# Altium project HERSEYBASTAN.PrjPcb
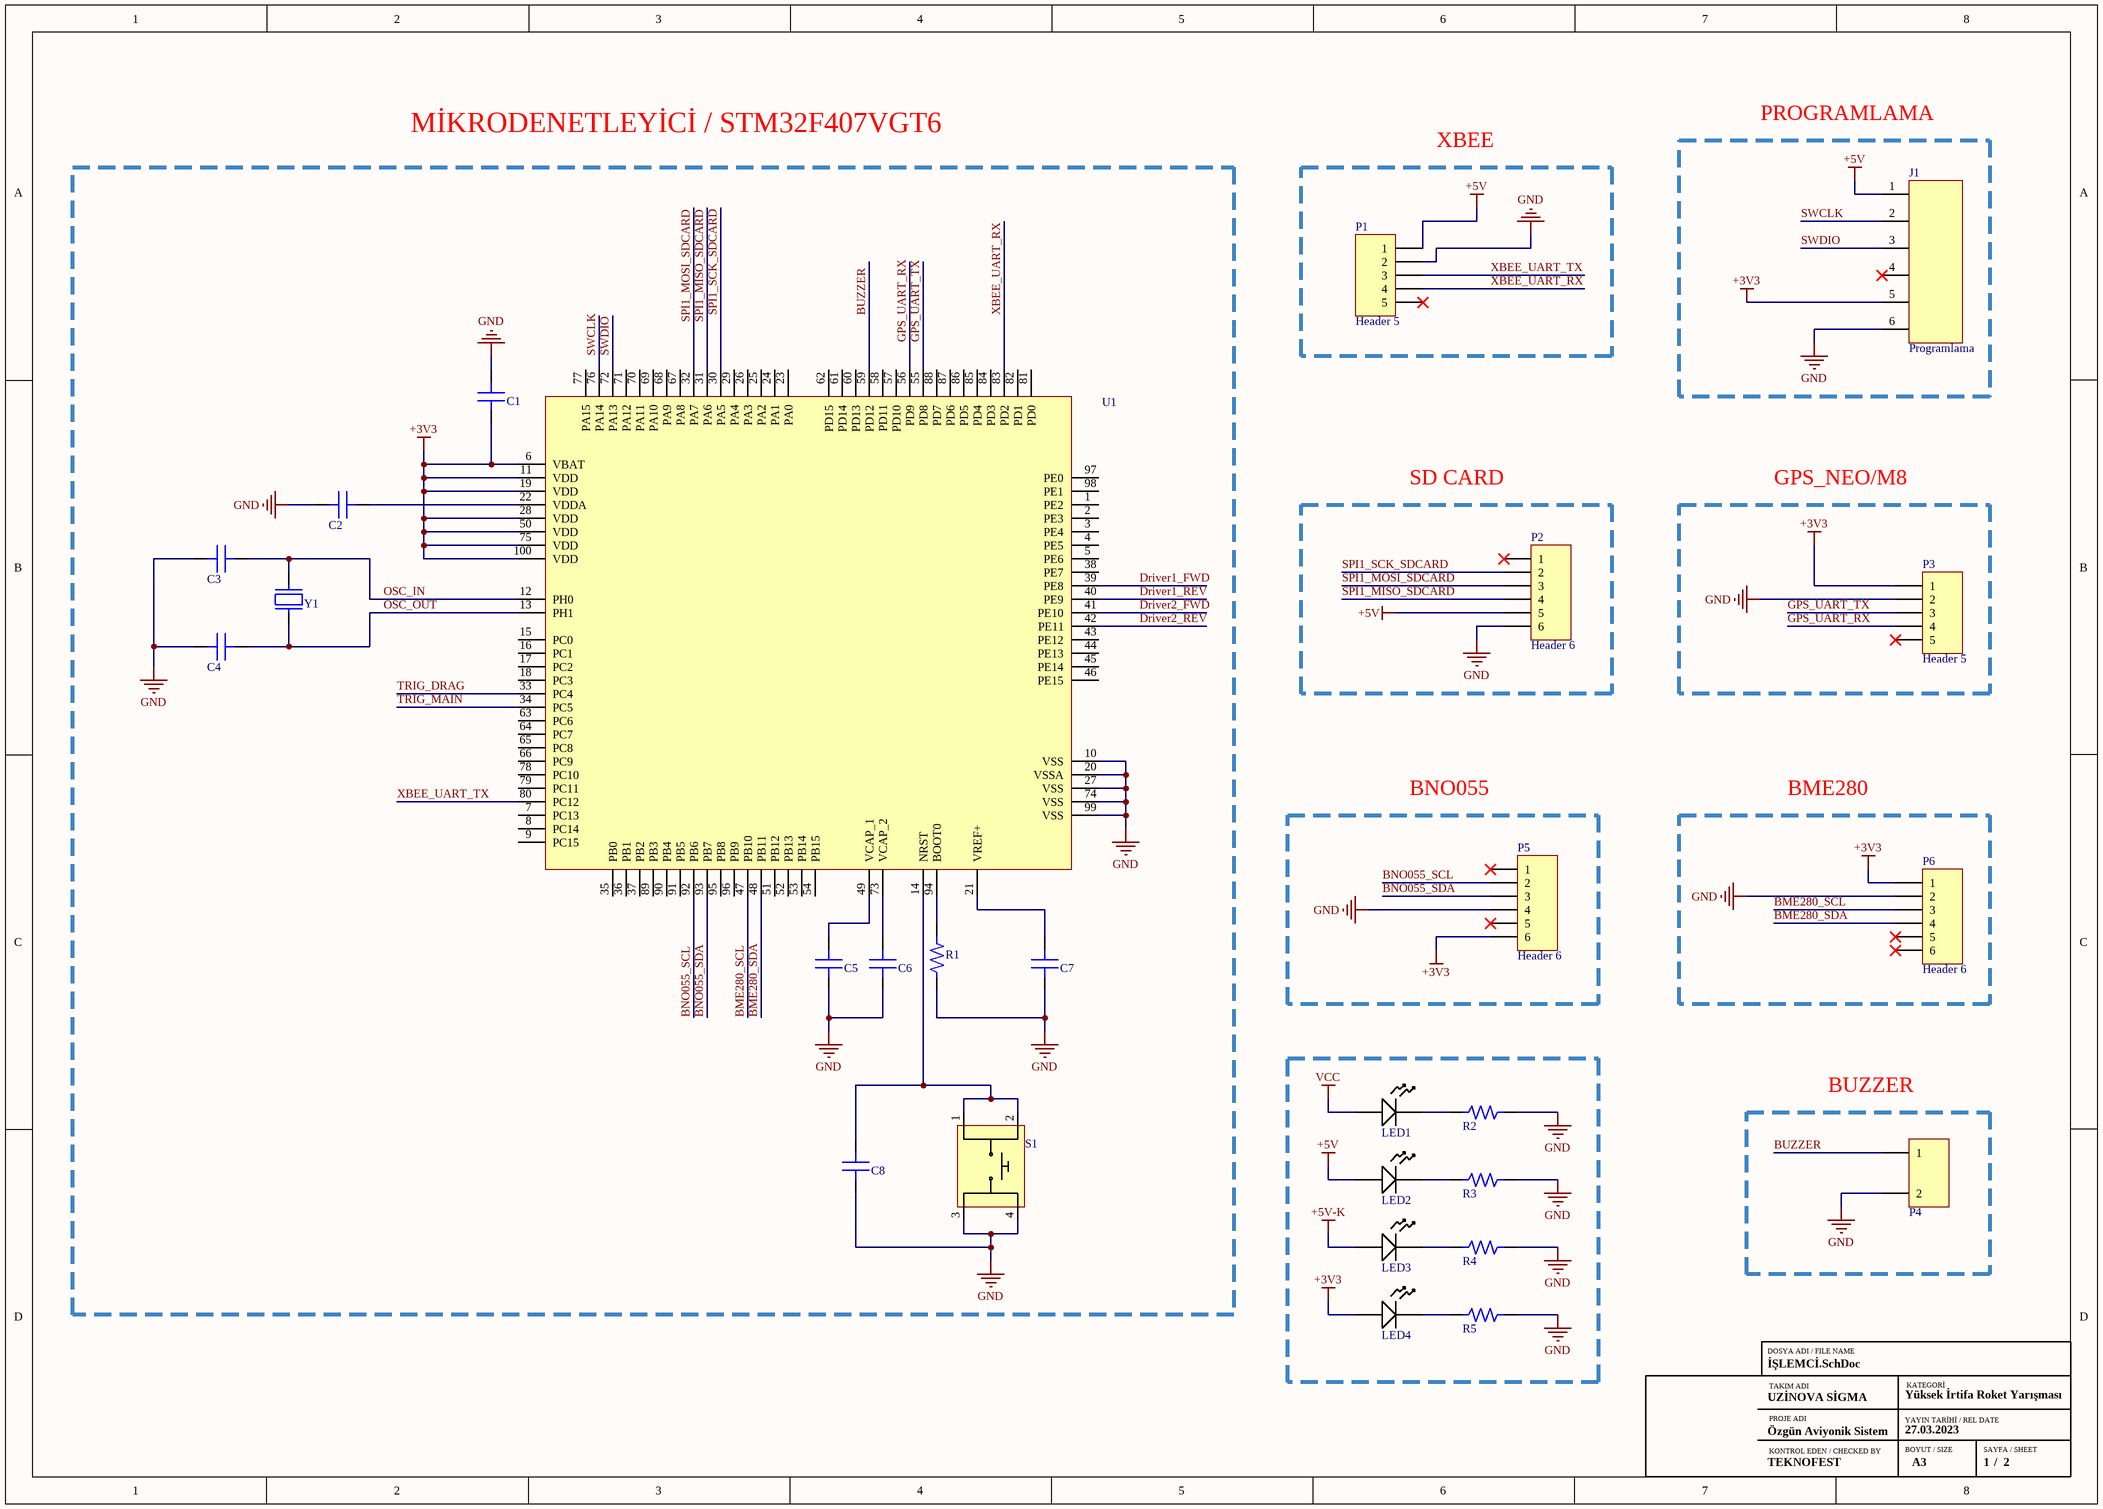
[diagram p0: İŞLEMCİ.SchDoc]
2 sheets, 70 parts. Net scope: global (net labels, ports and power ports of the same name join across sheets).
Board file: SON.PcbDoc
Sheets:
  İŞLEMCİ.SchDoc
  KURTARMA.SchDoc

## Sheet İŞLEMCİ.SchDoc
size A3; CheckedBy: TEKNOFEST; SheetNumber: 1; SheetTotal: 2; Takım_Adı: UZİNOVA SİGMA; Kategori: Yüksek İrtifa Roket Yarışması; Proje_Adı: Özgün Aviyonik Sistem; ReleaseDate: 27.03.2023; PageSize: A3

### Parts
C1  CAP CER 1uF 0805  [CAP_0805]  (value not drawn)
C2  CAP CER 10nF 0805  [CAP_0805]  (value not drawn)
C3  CAP CER 20pF 0805  [CAP_0805]  (value not drawn)
C4  CAP CER 20pF 0805  [CAP_0805]  (value not drawn)
C5  CAP CER 2.2uF 0805  [CAP_0805]  (value not drawn)
C6  CAP CER 2.2uF 0805  [CAP_0805]  (value not drawn)
C7  CAP CER 10nF 0805  [CAP_0805]  (value not drawn)
C8  CAP CER 0.1uF 0805  [CAP_0805]  (value not drawn)
J1  Programlama  [PPTC061LFBN-RC]
LED1  CMD17-21VRD/TR8  [LED RED_0805]  (value not drawn)
LED2  CMD17-21VRD/TR8  [LED RED_0805]  (value not drawn)
LED3  CMD17-21VRD/TR8  [LED RED_0805]  (value not drawn)
LED4  CMD17-21VRD/TR8  [LED RED_0805]  (value not drawn)
P1  Header 5  [HDR1X5]
P2  Header 6  [HDR1X6]
P3  Header 5  [HDR1X5]
P4  Yalancı Buzzer  [Yalancı Buzzer]  (value not drawn)
P5  Header 6  [HDR1X6]
P6  Header 6  [HDR1X6]
R1  RES 10K OHM 0805  [RES_0805]  (value not drawn)
R2  RES 470 OHM 0805  [RES_0805]  (value not drawn)
R3  RES 470 OHM 0805  [RES_0805]  (value not drawn)
R4  RES 470 OHM 0805  [RES_0805]  (value not drawn)
R5  RES 470 OHM 0805  [RES_0805]  (value not drawn)
S1  PTS815 SJG 250 SMTR LFS  [BUTTON]  (value not drawn)
U1  STM32F407VGT6  [LQFP-100]  (value not drawn)
Y1  CRYSTAL 32.7680KHZ 12.5PF SMD  [CRYSTAL_ABS05]  (value not drawn)

### Blocks framed on the sheet
XBEE: P1
PROGRAMLAMA: J1
SD CARD: P2
GPS_NEO/M8: P3
BNO055: P5
BME280: P6
BUZZER: P4

### Nets
+3V3: C1.1 J1.5 LED4.1 P3.1 P5.6 P6.1 U1.6(VBAT) U1.11(VDD) U1.19(VDD) U1.28(VDD) U1.50(VDD) U1.75(VDD) U1.100(VDD)
+5V: J1.1 LED2.1 P1.1 P2.5
+5V-K: LED3.1
GND: C1.2 C2.1 C3.1 C4.1 C5.1 C6.1 C7.1 C8.1 J1.6 P1.2 P2.6 P3.2 P4.2 P5.4 P6.2 R1.1 R2.2 R3.2 R4.2 R5.2 S1.3 S1.4 U1.10(VSS) U1.20(VSSA) U1.27(VSS) U1.74(VSS) U1.99(VSS)
VCC: LED1.1
BME280_SCL: P6.3 U1.47(PB10)
BME280_SDA: P6.4 U1.48(PB11)
BNO055_SCL: P5.2 U1.92(PB6)
BNO055_SDA: P5.3 U1.93(PB7)
BUZZER: P4.1 U1.59(PD12)
Driver1_FWD: U1.39(PE8)
Driver1_REV: U1.40(PE9)
Driver2_FWD: U1.41(PE10)
Driver2_REV: U1.42(PE11)
GPS_UART_RX: P3.4 U1.56(PD9)
GPS_UART_TX: P3.3 U1.55(PD8)
OSC_IN: C3.2 U1.12(PH0) Y1.2
OSC_OUT: C4.2 U1.13(PH1) Y1.1
SPI1_MISO_SDCARD: P2.4 U1.31(PA6)
SPI1_MOSI_SDCARD: P2.3 U1.32(PA7)
SPI1_SCK_SDCARD: P2.2 U1.30(PA5)
SWCLK: J1.2 U1.76(PA14)
SWDIO: J1.3 U1.72(PA13)
TRIG_DRAG: U1.33(PC4)
TRIG_MAIN: U1.34(PC5)
XBEE_UART_RX: P1.4 U1.83(PD2)
XBEE_UART_TX: P1.3 U1.80(PC12)
NetC2_2: C2.2 U1.22(VDDA)
NetC5_2: C5.2 U1.49(VCAP_1)
NetC6_2: C6.2 U1.73(VCAP_2)
NetC7_2: C7.2 U1.21(VREF+)
NetC8_2: C8.2 S1.1 S1.2 U1.14(NRST)
NetLED1_2: LED1.2 R2.1
NetLED2_2: LED2.2 R3.1
NetLED3_2: LED3.2 R4.1
NetLED4_2: LED4.2 R5.1
NetR1_2: R1.2 U1.94(BOOT0)

Not connected (* = marked no-connect by the designer): J1 4*; P1 5*; P2 1*; P3 5*; P5 1* 5*; P6 5* 6*; U1 1(PE2) 2(PE3) 3(PE4) 4(PE5) 5(PE6) 7(PC13) 8(PC14) 9(PC15) 15(PC0) 16(PC1) 17(PC2) 18(PC3) 23(PA0) 24(PA1) 25(PA2) 26(PA3) 29(PA4) 35(PB0) 36(PB1) 37(PB2) 38(PE7) 43(PE12) 44(PE13) 45(PE14) 46(PE15) 51(PB12) 52(PB13) 53(PB14) 54(PB15) 57(PD10) 58(PD11) 60(PD13) 61(PD14) 62(PD15) 63(PC6) 64(PC7) 65(PC8) 66(PC9) 67(PA8) 68(PA9) 69(PA10) 70(PA11) 71(PA12) 77(PA15) 78(PC10) 79(PC11) 81(PD0) 82(PD1) 84(PD3) 85(PD4) 86(PD5) 87(PD6) 88(PD7) 89(PB3) 90(PB4) 91(PB5) 95(PB8) 96(PB9) 97(PE0) 98(PE1)

### Notes on the sheet
- MİKRODENETLEYİCİ / STM32F407VGT6
- (near C7) BOOT0 ekleme yapılabilir-amerika roket
- DOSYA ADI / FILE NAME
- TAKIM ADI
- KATEGORİ
- KONTROL EDEN / CHECKED BY
- PROJE ADI
- BOYUT / SIZE
- YAYIN TARİHİ / REL DATE
- SAYFA / SHEET
- /

### Library data of the parts
LED1-LED4 = LED RED: LED Uni-Color Red 640nm 2-Pin SMT T/R; Manufacturer: VCC CHML; Power Rating: 100mW; Luminous Intensity: 6mcd; Viewing Angle: 140°; Lens Style: Diffused,Tinted,Rectangular,Colored; Forward Current: 20mA; Forward Voltage: 2V; Reverse Voltage (DC): 5V; Number of LEDs: 1; Supplier 1: Digi-Key; Manufacturer Part Number: CMD17-21VRD/TR8; RoHS: Yes; Category: LEDs; Stock 1: 357228; Pricing 1: 1=0,73000, 10=0,47800, 100=0,31310, 1000=0,24720 (USD); Mount: Surface Mount; Case/Package: 0805; Number of Pins: 2; Color: Red; Case Code (Metric): 2012; Case Code (Imperial): 0805; Lens Color: Red; Min Operating Temperature: -40°C; Max Operating Temperature: 85°C; Packaging: Tape and Reel; Package Quantity: 1; Illumination Color: Red; Test Current: 20mA; Wavelength: 640nm; Reverse Voltage: 5V; Length: 2mm; Width: 1.25mm; Height: 1.1mm; RoHS Compliant: Yes; Lead Free: Lead Free; ComponentLink1URL: http://www.mouser.com/ds/2/423/CMD1721ver1-1064576.pdf?src-supplier=Mouser; ComponentLink1Description: http://www.mouser.com/ds/2/423/CMD1721ver1-1064576.pdf?src-supplier=Mouser; ComponentLink2URL: https://www.alliedelec.com/m/d/ea8f758becbd32522d2612194452bcae.pdf?src-supplier=Allied+Electronics; ComponentLink2Description: https://www.alliedelec.com/m/d/ea8f758becbd32522d2612194452bcae.pdf?src-supplier=Allied+Electronics; ComponentLink3URL: http://www.onlinecomponents.com/productFiles/mf-CM/2cmd17-21seriessmtleds0805packagesize.pdf?src-supplier=Onlinecomponents.com; ComponentLink3Description: http://www.onlinecomponents.com/productFiles/mf-CM/2cmd17-21seriessmtleds0805packagesize.pdf?src-supplier=Onlinecomponents.com; ComponentLink4URL: https://vcclite.com/wp-content/uploads/wpallimport/files/files/CMD1721Seriesver3.pdf?src-supplier=Digi-Key; ComponentLink4Description: https://vcclite.com/wp-content/uploads/wpallimport/files/files/CMD1721Seriesver3.pdf?src-supplier=Digi-Key; Supplier Part Number 1: L62501CT-ND
P1 P3 = Header 5: Header, 5-Pin; LatestRevisionDate: 17-Jul-2002; LatestRevisionNote: Re-released for DXP Platform.; Publisher: Altium Limited
P2 P5 P6 = Header 6: Header, 6-Pin; LatestRevisionDate: 17-Jul-2002; LatestRevisionNote: Re-released for DXP Platform.; Publisher: Altium Limited
S1 = BUTTON: Switch Tactile N.O. SPST Button J-Bend 0.05A 12VDC 3.92N SMD T/R; Manufacturer: ITT C&K; Supplier 1: Digi-Key; Manufacturer Part Number: PTS815SJG250SMTRLFS; RoHS: Yes; Category: Tactile Switches; Stock 1: 47215; Pricing 1: 1=0,22000, 10=0,21400, 25=0,20280, 100=0,18360, 250=0,16736, 500=0,15558, 1000=0,13271 (USD); Supplier Part Number 1: CKN12217-1-ND
U1 = STM32F407VGT6: IC MCU 32BIT 1MB FLASH 100LQFP; Manufacturer: STMicroelectronics; Core Architecture: ARM; Interface: I2C,SPI,USB,CAN,Ethernet,IrDA,UART,USART,LIN,EBI/EMI,I2S; Data Bus Width: 32b; Max Supply Voltage: 3.6V; Min Supply Voltage: 1.8V; Number of I/Os: 82; Frequency: 168MHz; RAM Size: 196KB; Oscillator Type: Internal; Memory Size: 1024KB; Peripherals: Brown-out Detect/Reset,POR,PWM,WDT,DMA,LCD,I2C; Number of Timers/Counters: 14; Watchdog Timer: Yes; Number of ADC Channels: 16; Number of PWM Channels: 2; Number of SPI Channels: 3; Number of Ethernet Channels: 1; Supplier 1: Digi-Key; Manufacturer Part Number: STM32F407VGT6; RoHS: Yes; Category: Microcontrollers; Pricing 1: 1=16,52000, 10=15,18400, 25=14,55440, 90=12,82367, 270=12,19433, 450=11,40760 (USD); Case/Package: LQFP; Number of Pins: 100; Min Operating Temperature: -40°C; Max Operating Temperature: 85°C; Series: STM32 F4; Package Quantity: 90; Packaging: Tray; Max Frequency: 168MHz; Memory Type: FLASH; Number of Programmable I/O: 82; Number of I2C Channels: 3; Number of UART Channels: 2; Address Bus Width: 32b; Length: 14.2mm; Width: 14.2mm; Height: 1.45mm; Radiation Hardening: No; Reach SVHC Compliant: Yes; Lead Free: Lead Free; RoHS Compliant: Yes; ComponentLink1URL: https://datasheet.ciiva.com/14132/stm32f407vgt6-tds-eng-14132567.pdf?src-supplier=Distrelec; ComponentLink1Description: https://datasheet.ciiva.com/14132/stm32f407vgt6-tds-eng-14132567.pdf?src-supplier=Distrelec; ComponentLink2URL: https://datasheet.ciiva.com/4842/dm00037051-492832-4842280.pdf?src-supplier=Mouser; ComponentLink2Description: https://datasheet.ciiva.com/4842/dm00037051-492832-4842280.pdf?src-supplier=Mouser; ComponentLink3URL: https://datasheet.ciiva.com/48687/001075599-da-01-en-mcu-32bt-1mb-stm32f407vgt6-lqfp-100-stm-48687547.pdf?src-supplier=Conrad; ComponentLink3Description: https://datasheet.ciiva.com/48687/001075599-da-01-en-mcu-32bt-1mb-stm32f407vgt6-lqfp-100-stm-48687547.pdf?src-supplier=Conrad; Supplier Part Number 1: 497-11605-ND
Y1 = CRYSTAL: Crystal 0.032768MHz ±20ppm (Tol) 12.5pF Flexural 90000Ohm 2-Pin CSMD T/R; Manufacturer: Abracon; Manufacturer Part Number: ABS05-32.768KHZ-T; Frequency: 32.768kHz; ESR (Equivalent Series Resistance): 90kR; Operating Frequency: 32.768 kHz; Supplier 1: Digi-Key; RoHS: Yes; Category: Crystals; Stock 1: 376220; Pricing 1: 1=0,66000, 10=0,58100, 50=0,54340, 100=0,48020, 500=0,45494, 1000=0,37911 (USD); Mount: Surface Mount; Case/Package: CSMD; Number of Pins: 2; Min Operating Temperature: -40°C; Max Operating Temperature: 85°C; Packaging: Tape and Reel; Frequency Tolerance: 20ppm; Load Capacitance: 12.5pF; Package Quantity: 3000; Tolerance: 20ppm; Termination: SMD/SMT; Series Resistance: 90kR; Series: ABS05; Length: 1.6mm; Width: 1mm; Height: 0.5mm; Depth: 1mm; Radiation Hardening: No; Reach SVHC Compliant: Yes; Lead Free: Lead Free; RoHS Compliant: Yes; ComponentLink1URL: https://datasheet.ciiva.com/23810/abs05-23810480.pdf?src-supplier=Newark; ComponentLink1Description: https://datasheet.ciiva.com/23810/abs05-23810480.pdf?src-supplier=Newark; ComponentLink2URL: https://datasheet.ciiva.com/6728/abs05-6728949.pdf?src-supplier=Digi-Key; ComponentLink2Description: https://datasheet.ciiva.com/6728/abs05-6728949.pdf?src-supplier=Digi-Key; ComponentLink3URL: https://datasheet.ciiva.com/6728/abs05-6728950.pdf?src-supplier=Digi-Key; ComponentLink3Description: https://datasheet.ciiva.com/6728/abs05-6728950.pdf?src-supplier=Digi-Key; ComponentLink4URL: https://datasheet.ciiva.com/16411/abs05-16411149.pdf?src-supplier=Future+Electronics; ComponentLink4Description: https://datasheet.ciiva.com/16411/abs05-16411149.pdf?src-supplier=Future+Electronics; Supplier Part Number 1: 535-11899-1-ND

## Sheet KURTARMA.SchDoc
size A3; CheckedBy: TEKNOFEST; SheetNumber: 2; SheetTotal: 2; Takım_Adı: UZİNOVA SİGMA; Kategori: Yüksek İrtifa Roket Yarışması; Proje_Adı: Özgün Aviyonik Sistem; ReleaseDate: 27.03.2023; PageSize: A3
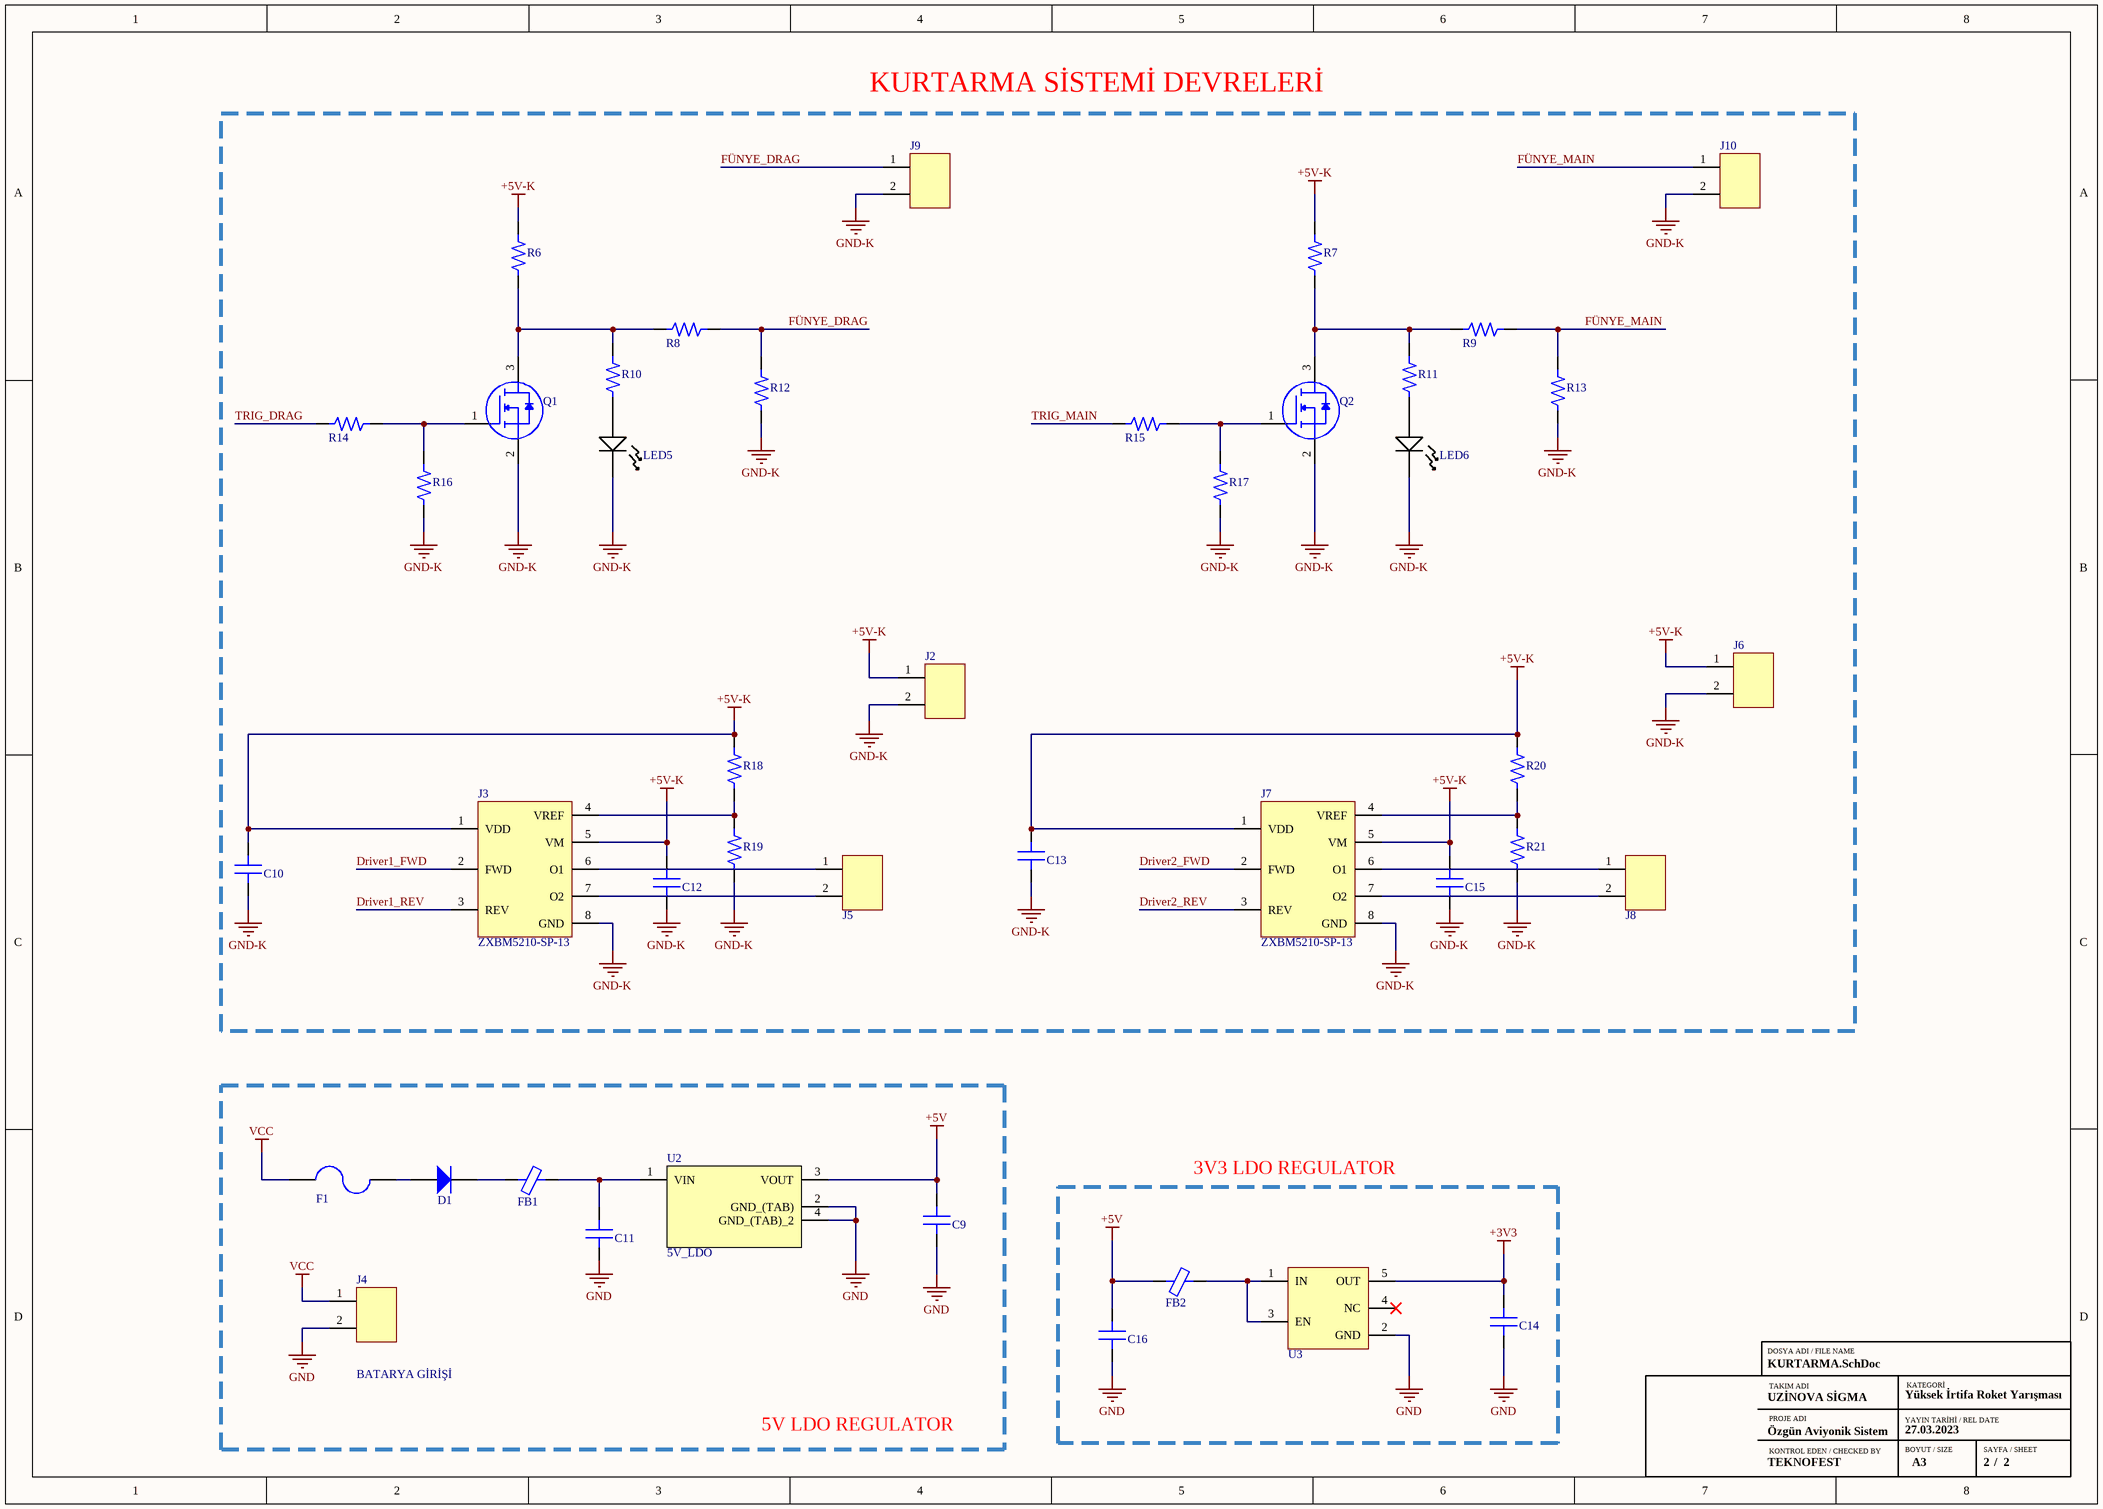
[diagram p1: KURTARMA.SchDoc]

### Parts
C9  CAP CER 10uF 0805  [CAP_0805]  (value not drawn)
C10  CAP CER 1uF 0805  [CAP_0805]  (value not drawn)
C11  CAP CER 10uF 0805  [CAP_0805]  (value not drawn)
C12  CAP CER 10uF 0805  [CAP_0805]  (value not drawn)
C13  CAP CER 1uF 0805  [CAP_0805]  (value not drawn)
C14  CAP CER 1uF 0805  [CAP_0805]  (value not drawn)
C15  CAP CER 10uF 0805  [CAP_0805]  (value not drawn)
C16  CAP CER 1uF 0805  [CAP_0805]  (value not drawn)
D1  DIODE GEN PURP 75V 150MA SOD323F  [SOD323F]  (value not drawn)
F1  FUSE 3413.0216.22  [FUSE_1206]  (value not drawn)
FB1  MPZ2012S601AT000  [FERRITE BEAD_0805]  (value not drawn)
FB2  MPZ2012S601AT000  [FERRITE BEAD_0805]  (value not drawn)
J2  Mike Connector  [MIKE CONNECTOR]  (value not drawn)
J3  ZXBM5210-SP-13  [SO-8EP]
J4  Mike Connector  [MIKE CONNECTOR]  (value not drawn)
J5  HEADER x2  [HEADER x2]  (value not drawn)
J6  Mike Connector  [MIKE CONNECTOR]  (value not drawn)
J7  ZXBM5210-SP-13  [SO-8EP]
J8  HEADER x2  [HEADER x2]  (value not drawn)
J9  Mike Connector  [MIKE CONNECTOR]  (value not drawn)
J10  Mike Connector  [MIKE CONNECTOR]  (value not drawn)
LED5  CMD17-21VRD/TR8  [LED RED_0805]  (value not drawn)
LED6  CMD17-21VRD/TR8  [LED RED_0805]  (value not drawn)
Q1  NTR5103NT1G  [SOT-23-3]  (value not drawn)
Q2  NTR5103NT1G  [SOT-23-3]  (value not drawn)
R6  RES 0 OHM 0805  [RES_0805]  (value not drawn)
R7  RES 0 OHM 0805  [RES_0805]  (value not drawn)
R8  RES 20K OHM 0805  [RES_0805]  (value not drawn)
R9  RES 20K OHM 0805  [RES_0805]  (value not drawn)
R10  RES 470 OHM 0805  [RES_0805]  (value not drawn)
R11  RES 470 OHM 0805  [RES_0805]  (value not drawn)
R12  RES 10K OHM 0805  [RES_0805]  (value not drawn)
R13  RES 10K OHM 0805  [RES_0805]  (value not drawn)
R14  RES 1K OHM 0805  [RES_0805]  (value not drawn)
R15  RES 1K OHM 0805  [RES_0805]  (value not drawn)
R16  RES 10K OHM 0805  [RES_0805]  (value not drawn)
R17  RES 10K OHM 0805  [RES_0805]  (value not drawn)
R18  RES 1K OHM 0805  [RES_0805]  (value not drawn)
R19  RES 1K OHM 0805  [RES_0805]  (value not drawn)
R20  RES 1K OHM 0805  [RES_0805]  (value not drawn)
R21  RES 1K OHM 0805  [RES_0805]  (value not drawn)
U2  5V_LDO  [5V_LDO]
U3  NCP161ASN330T1G  [SOT-23-5]  (value not drawn)

### Blocks framed on the sheet
KURTARMA SİSTEMİ DEVRELERİ: C10 C12 C13 C15 J2 J3 J5-J10 LED5 LED6 Q1 Q2 R6-R21
5V LDO REGULATOR: C9 C11 D1 F1 FB1 J4 U2
3V3 LDO REGULATOR: C14 C16 FB2 U3

### Nets
+3V3: C14.2 U3.5(OUT)
+5V: C9.2 C16.2 FB2.1 U2.3(VOUT)
+5V-K: C10.2 C12.2 C13.2 C15.2 J2.1 J3.1(VDD) J3.5(VM) J6.1 J7.1(VDD) J7.5(VM) R6.2 R7.2 R18.2 R20.2
GND: C9.1 C11.1 C14.1 C16.1 J4.2 U2.2(GND_(TAB)) U2.4(GND_(TAB)_2) U3.2(GND)
GND-K: C10.1 C12.1 C13.1 C15.1 J2.2 J3.8(GND) J6.2 J7.8(GND) J9.2 J10.2 LED5.2 LED6.2 Q1.2(S) Q2.2(S) R12.1 R13.1 R16.1 R17.1 R19.1 R21.1
VCC: F1.1 J4.1
Driver1_FWD: J3.2(FWD)
Driver1_REV: J3.3(REV)
Driver2_FWD: J7.2(FWD)
Driver2_REV: J7.3(REV)
FÜNYE_DRAG: J9.1 R8.2 R12.2
FÜNYE_MAIN: J10.1 R9.2 R13.2
TRIG_DRAG: R14.1
TRIG_MAIN: R15.1
NetC11_2: C11.2 FB1.2 U2.1(VIN)
NetD1_1: D1.1(CATHODE) FB1.1
NetD1_2: D1.2(ANODE) F1.2
NetFB2_2: FB2.2 U3.1(IN) U3.3(EN)
NetJ3_4: J3.4(VREF) R18.1 R19.2
NetJ3_6: J3.6(O1) J5.1
NetJ3_7: J3.7(O2) J5.2
NetJ7_4: J7.4(VREF) R20.1 R21.2
NetJ7_6: J7.6(O1) J8.1
NetJ7_7: J7.7(O2) J8.2
NetLED5_1: LED5.1 R10.1
NetLED6_1: LED6.1 R11.1
NetQ1_1: Q1.1(G) R14.2 R16.2
NetQ1_3: Q1.3(D) R6.1 R8.1 R10.2
NetQ2_1: Q2.1(G) R15.2 R17.2
NetQ2_3: Q2.3(D) R7.1 R9.1 R11.2

Not connected (* = marked no-connect by the designer): U3 4(NC)*

### Notes on the sheet
- ANLADIĞIM KADARIYLA MOSFET TETİKLENDİĞİNDE FÜNYE PATLİCAK
- (near J4) BATARYA GİRİŞİ
- (near U3) Datasheet'te EN pininin input voltajıyla aynı olduğu görülüyo
- - Yüksek frekanslı gürültü ve istenmeyen durumlarda, belirlenen frekans aralığının dışında direnç etkisi gösterir, gürültüyü ısı enerjisine çevirerek absorbe ederler. Devrede güç veya sinyal hattına seri bağlanırlar ve alçak geçiren filtre elde edilir.
  - Elektromanyetik ve radyo frekans girşimini azaltır.
  -Kısaca yüksek frekanstaki sinyalleri önleyen pasif bir komponenttir.
  -Bypass kondansatörleri ile ferritler güç bağlantısında beraber kullanılır.
- DOSYA ADI / FILE NAME
- TAKIM ADI
- KATEGORİ
- KONTROL EDEN / CHECKED BY
- PROJE ADI
- BOYUT / SIZE
- YAYIN TARİHİ / REL DATE
- SAYFA / SHEET
- /

### Library data of the parts
D1 = DIODE: VR=75V IF=150mA Trr=4ns P=200mW; Manufacturer: ON Semiconductor / Fairchild; Manufacturer Part Number: 1N4148WS; Element Configuration: Single; Reverse Recovery Time: 4ns; Forward Voltage: 1V; Max Reverse Current: 5uA; Power Dissipation: 200mW; Max Forward Surge Current (Ifsm): 2A; Supplier 1: Digi-Key; RoHS: Yes; Category: Rectifier Diodes; Stock 1: 973654; Pricing 1: 1=0,21000, 10=0,19200, 100=0,10460, 500=0,06436, 1000=0,04388 (USD); Mount: Surface Mount; Number of Pins: 2; Contact Plating: Tin,Matte; Weight: 0.0276g; Min Operating Temperature: -55°C; Max Operating Temperature: 150°C; Packaging: Tape and Reel; Forward Current: 150mA; Max Repetitive Reverse Voltage (Vrrm): 75V; Package Quantity: 1; Average Rectified Current: 150mA; Max Reverse Voltage (DC): 75V; Recovery Time: 4ns; Series: -; Reverse Voltage: 75V; Length: 1.8mm; Width: 1.35mm; Height: 1mm; Radiation Hardening: No; RoHS Compliant: Yes; Lead Free: Lead Free; Reach SVHC Compliant: Yes; ComponentLink1URL: https://datasheet.ciiva.com/30479/0900766b810e1cd3-30479206.pdf?src-supplier=Rs; ComponentLink1Description: https://datasheet.ciiva.com/30479/0900766b810e1cd3-30479206.pdf?src-supplier=Rs; ComponentLink2URL: https://datasheet.ciiva.com/15208/getdatasheetpartid-127819-15208358.pdf?src-supplier=Verical; ComponentLink2Description: https://datasheet.ciiva.com/15208/getdatasheetpartid-127819-15208358.pdf?src-supplier=Verical; ComponentLink3URL: https://datasheet.ciiva.com/8300/1n914bws-8300360.pdf?src-supplier=Avnet; ComponentLink3Description: https://datasheet.ciiva.com/8300/1n914bws-8300360.pdf?src-supplier=Avnet; ComponentLink4URL: https://datasheet.ciiva.com/910/1n4148ws-910381.pdf?src-supplier=Digi-Key; ComponentLink4Description: https://datasheet.ciiva.com/910/1n4148ws-910381.pdf?src-supplier=Digi-Key; ComponentLink5URL: https://datasheet.ciiva.com/910/1n4148ws-910382.pdf?src-supplier=Digi-Key; ComponentLink5Description: https://datasheet.ciiva.com/910/1n4148ws-910382.pdf?src-supplier=Digi-Key; ComponentLink6URL: https://datasheet.ciiva.com/910/1n4148ws-910380.pdf?src-supplier=Digi-Key; ComponentLink6Description: https://datasheet.ciiva.com/910/1n4148ws-910380.pdf?src-supplier=Digi-Key; Supplier Part Number 1: 1N4148WSFSDKR-ND
F1 = FUSE: Fuse Chip Fast Acting 1A 32V SMD Solder Pad 1206 Glass T/R VDE/cULus; Manufacturer: Schurter; Body Material: Glass,Epoxy; Max Voltage Rating (DC): 63V; DC Cold Resistance: 94.2mR; Fuse Type: Board Mount (Cartridge Style Excluded); Approvals: VDE,cURus; Supplier 1: Digi-Key; Manufacturer Part Number: 3413.0216.22; RoHS: Yes; Category: Fuses; Stock 1: 6832; Pricing 1: 1=0,67000, 50=0,52400, 100=0,39700, 500=0,32624 (USD); Mount: Surface Mount,PCB; Case/Package: 1206; Number of Pins: 2; Weight: 0.000212oz; Case Code (Metric): 3216; Case Code (Imperial): 1206; Contact Plating: Gold; Housing Material: Glass; Terminal Material: Tin; Min Operating Temperature: -55°C; Max Operating Temperature: 90°C; Current Rating: 1A; Package Quantity: 1000; Voltage Rating (AC): 32V; Voltage Rating (DC): 63V; Packaging: Tape and Reel; Max Voltage Rating (AC): 32V; Voltage Rating: 32V; Termination: SMD/SMT; Working Voltage: 32V; Series: USI 1206; Length: 3.2mm; Width: 1.6mm; Height: 0.6mm; Depth: 1.6mm; Radiation Hardening: No; Lead Free: Lead Free; RoHS Compliant: Yes; ComponentLink1URL: https://datasheet.ciiva.com/301/typ-usi-1206-301440.pdf?src-supplier=Digi-Key; ComponentLink1Description: https://datasheet.ciiva.com/301/typ-usi-1206-301440.pdf?src-supplier=Digi-Key; ComponentLink2URL: https://datasheet.ciiva.com/14541/70160006-14541114.pdf?src-supplier=Allied+Electronics; ComponentLink2Description: https://datasheet.ciiva.com/14541/70160006-14541114.pdf?src-supplier=Allied+Electronics; ComponentLink3URL: https://datasheet.ciiva.com/301/typ-usi-1206-301439.pdf?src-supplier=Digi-Key; ComponentLink3Description: https://datasheet.ciiva.com/301/typ-usi-1206-301439.pdf?src-supplier=Digi-Key; ComponentLink4URL: https://datasheet.ciiva.com/301/typ-usi-1206-301441.pdf?src-supplier=Digi-Key; ComponentLink4Description: https://datasheet.ciiva.com/301/typ-usi-1206-301441.pdf?src-supplier=Digi-Key; ComponentLink5URL: https://datasheet.ciiva.com/8264/typ-usi-1206-8264583.pdf?src-supplier=Avnet; ComponentLink5Description: https://datasheet.ciiva.com/8264/typ-usi-1206-8264583.pdf?src-supplier=Avnet; ComponentLink6URL: https://datasheet.ciiva.com/14102/qousi1206-data-e-14102903.pdf?src-supplier=Distrelec; ComponentLink6Description: https://datasheet.ciiva.com/14102/qousi1206-data-e-14102903.pdf?src-supplier=Distrelec; ComponentLink7URL: https://datasheet.ciiva.com/16316/typ-usi-1206-16316588.pdf?src-supplier=Future+Electronics; ComponentLink7Description: https://datasheet.ciiva.com/16316/typ-usi-1206-16316588.pdf?src-supplier=Future+Electronics; Supplier Part Number 1: 486-1144-1-ND
FB1 FB2 = FERRITE BEAD: 0805 600Ω ±25% DCR=0.1Ω 2A; Manufacturer: TDK; Impedance: 600R; DC Resistance (DCR): 100mR; Number of Lines: 1; Supplier 1: Digi-Key; Manufacturer Part Number: MPZ2012S601AT000; RoHS: Yes; Category: Ferrite Beads and Chips; Stock 1: 1942; Pricing 1: 1=0,11000, 10=0,09200, 25=0,08320, 50=0,06100, 100=0,05270, 250=0,04160, 500=0,03512, 1000=0,02957 (USD); Mount: Surface Mount; Case/Package: 0805; Case Code (Metric): 2012; Case Code (Imperial): 0805; Min Operating Temperature: -55°C; Max Operating Temperature: 125°C; Packaging: Tape and Reel; Package Quantity: 1; Current Rating: 2A; Max DC Current: 2A; Series: MPZ; Max Current Rating: 2A; Length: 0.079inch; Width: 0.049inch; Height: 0.041inch; Reach SVHC Compliant: Yes; Lead Free: Lead Free; RoHS Compliant: Yes; ComponentLink1URL: https://datasheet.ciiva.com/46634/beads-commercial-power-mpz-en-46634335.pdf?src-supplier=Digi-Key; ComponentLink1Description: https://datasheet.ciiva.com/46634/beads-commercial-power-mpz-en-46634335.pdf?src-supplier=Digi-Key; ComponentLink2URL: https://datasheet.ciiva.com/46634/beads-commercial-power-mpz-en-46634377.pdf?src-supplier=Digi-Key; ComponentLink2Description: https://datasheet.ciiva.com/46634/beads-commercial-power-mpz-en-46634377.pdf?src-supplier=Digi-Key; ComponentLink3URL: https://datasheet.ciiva.com/46634/beads-commercial-power-mpz-en-46634606.pdf?src-supplier=Digi-Key; ComponentLink3Description: https://datasheet.ciiva.com/46634/beads-commercial-power-mpz-en-46634606.pdf?src-supplier=Digi-Key; Supplier Part Number 1: 445-MPZ2012S601AT000CT-ND
J3 J7 = Driver: ZXBM5210 Series 18 V 1.5 A Reversible DC Motor Drive with Speed Control-SOIC-8EP; Manufacturer: Diodes; Interface: PWM; Logic Function: AND GATE; Operating Supply Voltage: 18V; Supplier 1: Digi-Key; Manufacturer Part Number: ZXBM5210-SP-13; RoHS: Yes; Category: Motor Drivers; Stock 1: 172511; Pricing 1: 1=1,21000, 10=1,08000, 25=1,02560, 100=0,84230, 250=0,78740, 500=0,69584, 1000=0,54934 (USD); Mount: Surface Mount; Min Operating Temperature: -40°C; Max Operating Temperature: 125°C; Package Quantity: 2500; Packaging: Cut Tape; Lead Free: Lead Free; ComponentLink1URL: https://datasheet.ciiva.com/29599/zxbm5210-29599456.pdf?src-supplier=Digi-Key; ComponentLink1Description: https://datasheet.ciiva.com/29599/zxbm5210-29599456.pdf?src-supplier=Digi-Key; ComponentLink2URL: https://datasheet.ciiva.com/29599/zxbm5210-29599455.pdf?src-supplier=Digi-Key; ComponentLink2Description: https://datasheet.ciiva.com/29599/zxbm5210-29599455.pdf?src-supplier=Digi-Key; ComponentLink3URL: https://datasheet.ciiva.com/30043/zxbm5210-30043882.pdf?src-supplier=Avnet; ComponentLink3Description: https://datasheet.ciiva.com/30043/zxbm5210-30043882.pdf?src-supplier=Avnet; Supplier Part Number 1: ZXBM5210-SP-13DICT-ND
J5 J8 = HEADER x2: Conn Screw Type Terminal Block 2 POS 3.5mm Solder ST Thru-Hole 10A; Manufacturer: On-Shore Technology; Manufacturer Part Number: OSTTE020104; Plating: Steel; Number of Levels: 1; Number of Positions Per Level: 2; Voltage: 125V; Pitch: 0.138inch; Wire Gauge (Max): 26AWG; Wire Gauge (Min): 16AWG; Supplier 1: Digi-Key; RoHS: Yes; Category: Terminal Blocks; Stock 1: 73362; Pricing 1: 1=0,74000, 10=0,40200, 25=0,30040, 50=0,26780, 100=0,26260, 250=0,23108, 500=0,21008, 1000=0,18907, 5000=0,14180 (USD); Mount: Through Hole; Number of Pins: 2; Contact Plating: Tin; Color: Black; Housing Material: Thermoplastic; Min Operating Temperature: -30°C; Max Operating Temperature: 105°C; Current: 10A; Termination: Screw; Packaging: Bulk; ComponentLink1URL: http://www.on-shore.com/wp-content/uploads/2015/09/osttexx0164.pdf?src-supplier=Digi-Key; ComponentLink1Description: http://www.on-shore.com/wp-content/uploads/2015/09/osttexx0164.pdf?src-supplier=Digi-Key; ComponentLink2URL: http://www.on-shore.com/wp-content/uploads/2015/09/osttexx0164.pdf?src-supplier=Verical; ComponentLink2Description: http://www.on-shore.com/wp-content/uploads/2015/09/osttexx0164.pdf?src-supplier=Verical; ComponentLink3URL: http://www.on-shore.com/wp-content/uploads/2015/09/osttexx0164.pdf?src-supplier=Arrow+Electronics; ComponentLink3Description: http://www.on-shore.com/wp-content/uploads/2015/09/osttexx0164.pdf?src-supplier=Arrow+Electronics; Supplier Part Number 1: ED2740-ND
LED5 LED6 = LED RED: as LED1 on sheet İŞLEMCİ; Supplier 1: Digi-Key; Manufacturer Part Number: CMD17-21VRD/TR8; RoHS: Yes; Category: LEDs; Stock 1: 357228; Pricing 1: 1=0,73000, 10=0,47800, 100=0,31310, 1000=0,24720 (USD); Mount: Surface Mount; Case/Package: 0805; Number of Pins: 2; Color: Red; Case Code (Metric): 2012; Case Code (Imperial): 0805; Lens Color: Red; Min Operating Temperature: -40°C; Max Operating Temperature: 85°C; Packaging: Tape and Reel; Package Quantity: 1; Illumination Color: Red; Test Current: 20mA; Wavelength: 640nm; Reverse Voltage: 5V; Length: 2mm; Width: 1.25mm; Height: 1.1mm; RoHS Compliant: Yes; Lead Free: Lead Free; ComponentLink1URL: http://www.mouser.com/ds/2/423/CMD1721ver1-1064576.pdf?src-supplier=Mouser; ComponentLink1Description: http://www.mouser.com/ds/2/423/CMD1721ver1-1064576.pdf?src-supplier=Mouser; ComponentLink2URL: https://www.alliedelec.com/m/d/ea8f758becbd32522d2612194452bcae.pdf?src-supplier=Allied+Electronics; ComponentLink2Description: https://www.alliedelec.com/m/d/ea8f758becbd32522d2612194452bcae.pdf?src-supplier=Allied+Electronics; ComponentLink3URL: http://www.onlinecomponents.com/productFiles/mf-CM/2cmd17-21seriessmtleds0805packagesize.pdf?src-supplier=Onlinecomponents.com; ComponentLink3Description: http://www.onlinecomponents.com/productFiles/mf-CM/2cmd17-21seriessmtleds0805packagesize.pdf?src-supplier=Onlinecomponents.com; ComponentLink4URL: https://vcclite.com/wp-content/uploads/wpallimport/files/files/CMD1721Seriesver3.pdf?src-supplier=Digi-Key; ComponentLink4Description: https://vcclite.com/wp-content/uploads/wpallimport/files/files/CMD1721Seriesver3.pdf?src-supplier=Digi-Key; Supplier Part Number 1: L62501CT-ND
Q1 Q2 = MOSFET N-Channel: MOSFET N-CH 60V 0.26A SOT23; Manufacturer: ON Semiconductor; Continuous Drain Current (ID): 310mA; Rds On Max: 2.5R; Input Capacitance: 40pF; Max Power Dissipation: 300mW; Number of Channels: 1; Drain to Source Resistance: 1R; Gate to Source Voltage (Vgs): 30V; Fall Time: 3.6ns; Rise Time: 1.2ns; Turn-Off Delay Time: 4.8ns; Turn-On Delay Time: 1.7ns; FET Type: 1 N-Channel; Supplier 1: Digi-Key; Manufacturer Part Number: NTR5103NT1G; RoHS: Yes; Category: MOSFETs; Stock 1: 55356; Pricing 1: 1=0,25000, 10=0,20100, 100=0,10660, 500=0,07012, 1000=0,04768 (USD); Mount: Surface Mount; Case/Package: SOT-23-3; Number of Pins: 3; Contact Plating: Tin; Min Operating Temperature: -55°C; Max Operating Temperature: 150°C; Packaging: Tape and Reel; Drain to Source Voltage (Vdss): 60V; Drain to Source Breakdown Voltage: 60V; Package Quantity: 3000; Lead Free: Lead Free; RoHS Compliant: Yes; ComponentLink1URL: http://www.farnell.com/datasheets/2237046.pdf?src-supplier=Farnell; ComponentLink1Description: http://www.farnell.com/datasheets/2237046.pdf?src-supplier=Farnell; ComponentLink2URL: http://www.mouser.com/ds/2/308/NTR5103N-D-600006.pdf?src-supplier=Mouser; ComponentLink2Description: http://www.mouser.com/ds/2/308/NTR5103N-D-600006.pdf?src-supplier=Mouser; ComponentLink3URL: http://www.farnell.com/datasheets/2237046.pdf?src-supplier=Newark; ComponentLink3Description: http://www.farnell.com/datasheets/2237046.pdf?src-supplier=Newark; ComponentLink4URL: http://www.farnell.com/datasheets/2237046.pdf?src-supplier=Element14; ComponentLink4Description: http://www.farnell.com/datasheets/2237046.pdf?src-supplier=Element14; ComponentLink5URL: http://www.onsemi.com/pub/Collateral/NTR5103N-D.PDF?src-supplier=Avnet; ComponentLink5Description: http://www.onsemi.com/pub/Collateral/NTR5103N-D.PDF?src-supplier=Avnet; ComponentLink6URL: http://www.onsemi.com/pub/Collateral/NTR5103N-D.PDF?src-supplier=Digi-Key; ComponentLink6Description: http://www.onsemi.com/pub/Collateral/NTR5103N-D.PDF?src-supplier=Digi-Key; Supplier Part Number 1: NTR5103NT1GOSCT-ND
U3 = NCP161ASN330T1G: LDO Regulator, 450 mA, Ultra-High PSRR, Ultra-Low Noise 3.3V, SOT23-5L, Active Discharge; Manufacturer: ON Semiconductor; Voltage - Input (Max): 5.5V; Current - Output: 450mA; Supplier 1: Digi-Key; Manufacturer Part Number: NCP161ASN330T1G; RoHS: Yes; Category: Voltage Regulators - Linear; Stock 1: 4959; Pricing 1: 1=0,67000, 10=0,58900, 25=0,55320, 100=0,45160, 250=0,41948, 500=0,35700, 1000=0,28561 (USD); RoHS Compliant: Yes; ComponentLink1URL: http://www.farnell.com/datasheets/2815754.pdf?src-supplier=Farnell; ComponentLink1Description: http://www.farnell.com/datasheets/2815754.pdf?src-supplier=Farnell; Supplier Part Number 1: NCP161ASN330T1GOSCT-ND; Voltage - Output (Min/Fixed): 3.3V; Supplier Device Package: SOT-23-5

## Nets that join several sheets
+3V3: İŞLEMCİ (13 pins), KURTARMA (C14.2 U3.5)
+5V: İŞLEMCİ (J1.1 LED2.1 P1.1 P2.5), KURTARMA (C9.2 C16.2 FB2.1 U2.3)
+5V-K: İŞLEMCİ (LED3.1), KURTARMA (14 pins)
GND: İŞLEMCİ (27 pins), KURTARMA (8 pins)
VCC: İŞLEMCİ (LED1.1), KURTARMA (F1.1 J4.1)
Driver1_FWD: İŞLEMCİ (U1.39), KURTARMA (J3.2)
Driver1_REV: İŞLEMCİ (U1.40), KURTARMA (J3.3)
Driver2_FWD: İŞLEMCİ (U1.41), KURTARMA (J7.2)
Driver2_REV: İŞLEMCİ (U1.42), KURTARMA (J7.3)
TRIG_DRAG: İŞLEMCİ (U1.33), KURTARMA (R14.1)
TRIG_MAIN: İŞLEMCİ (U1.34), KURTARMA (R15.1)